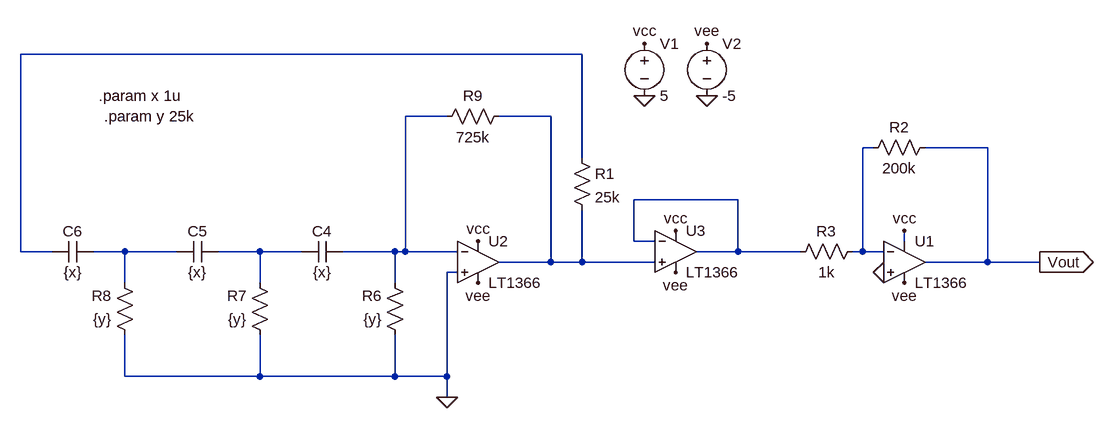
[diagram p0: schematic lfo_new.asc]
lfo_new.asc, the LTspice schematic file:
Version 4
SHEET 1 880 848
WIRE -496 48 -1360 48
WIRE -704 144 -768 144
WIRE -544 144 -624 144
WIRE -48 192 -64 192
WIRE 128 192 32 192
WIRE -496 208 -496 48
WIRE -256 272 -416 272
WIRE -416 336 -416 272
WIRE -384 336 -416 336
WIRE 0 336 0 320
WIRE -1360 352 -1360 48
WIRE -1312 352 -1360 352
WIRE -1200 352 -1248 352
WIRE -1120 352 -1200 352
WIRE -992 352 -1056 352
WIRE -928 352 -992 352
WIRE -784 352 -864 352
WIRE -768 352 -768 144
WIRE -768 352 -784 352
WIRE -688 352 -768 352
WIRE -256 352 -256 272
WIRE -256 352 -320 352
WIRE -160 352 -256 352
WIRE -64 352 -64 192
WIRE -64 352 -80 352
WIRE -32 352 -64 352
WIRE -544 368 -544 144
WIRE -544 368 -624 368
WIRE -496 368 -496 288
WIRE -496 368 -544 368
WIRE -384 368 -496 368
WIRE 128 368 128 192
WIRE 128 368 32 368
WIRE 208 368 128 368
WIRE -688 384 -704 384
WIRE -1200 400 -1200 352
WIRE -992 400 -992 352
WIRE -784 400 -784 352
WIRE -1200 544 -1200 480
WIRE -992 544 -992 480
WIRE -992 544 -1200 544
WIRE -784 544 -784 480
WIRE -784 544 -992 544
WIRE -704 544 -704 384
WIRE -704 544 -784 544
WIRE -704 576 -704 544
FLAG -704 576 0
FLAG -32 384 0
FLAG -304 112 0
FLAG -400 112 0
FLAG -400 32 vcc
FLAG -304 32 vee
FLAG -656 336 vcc
FLAG -352 320 vcc
FLAG 0 320 vcc
FLAG -656 400 vee
FLAG -352 384 vee
FLAG 0 400 vee
FLAG 208 368 Vout
IOPIN 208 368 Out
SYMBOL cap -864 336 R90
WINDOW 0 0 32 VBottom 2
WINDOW 3 32 32 VTop 2
SYMATTR InstName C4
SYMATTR Value {x}
SYMBOL cap -1056 336 R90
WINDOW 0 0 32 VBottom 2
WINDOW 3 32 32 VTop 2
SYMATTR InstName C5
SYMATTR Value {x}
SYMBOL cap -1248 336 R90
WINDOW 0 0 32 VBottom 2
WINDOW 3 32 32 VTop 2
SYMATTR InstName C6
SYMATTR Value {x}
SYMBOL res -768 496 R180
WINDOW 0 36 76 Left 2
WINDOW 3 36 40 Left 2
SYMATTR InstName R6
SYMATTR Value {y}
SYMBOL res -976 496 R180
WINDOW 0 36 76 Left 2
WINDOW 3 36 40 Left 2
SYMATTR InstName R7
SYMATTR Value {y}
SYMBOL res -1184 496 R180
WINDOW 0 36 76 Left 2
WINDOW 3 36 40 Left 2
SYMATTR InstName R8
SYMATTR Value {y}
SYMBOL res -720 160 R270
WINDOW 0 32 56 VTop 2
WINDOW 3 0 56 VBottom 2
SYMATTR InstName R9
SYMATTR Value 725k
SYMBOL Opamps/LT1366 -656 304 R0
SYMATTR InstName U2
SYMBOL res -512 192 R0
SYMATTR InstName R1
SYMATTR Value 25k
SYMBOL Opamps/LT1366 0 304 R0
SYMATTR InstName U1
SYMBOL res 48 176 R90
WINDOW 0 0 56 VBottom 2
WINDOW 3 32 56 VTop 2
SYMATTR InstName R2
SYMATTR Value 200k
SYMBOL res -64 336 R90
WINDOW 0 0 56 VBottom 2
WINDOW 3 32 56 VTop 2
SYMATTR InstName R3
SYMATTR Value 1k
SYMBOL Opamps/LT1366 -352 288 R0
SYMATTR InstName U3
SYMBOL voltage -400 16 R0
SYMATTR InstName V1
SYMATTR Value 5
SYMBOL voltage -304 16 R0
SYMATTR InstName V2
SYMATTR Value -5
TEXT -1240 112 Left 2 !.param x 1u
TEXT -1232 144 Left 2 !.param y 25k

The netlist it stands for:
* lfo_new.asc
C4 N002 N007 {x}
C5 N007 N006 {x}
C6 N006 N001 {x}
R6 0 N002 {y}
R7 0 N007 {y}
R8 0 N006 {y}
R9 N002 N003 725k
XU2 0 N002 vcc vee N003 LT1366  ; pins In+ In- V+ V- OUT
R1 N001 N003 25k
XU1 0 N004 vcc vee Vout LT1366  ; pins In+ In- V+ V- OUT
R2 Vout N004 200k
R3 N004 N005 1k
XU3 N003 N005 vcc vee N005 LT1366  ; pins In+ In- V+ V- OUT
V1 vcc 0 5
V2 vee 0 -5
.param x 1u
.param y 25k
.lib LTC.lib
.backanno
.end